# EAGLE design SMeter_Display_RevA (EAGLE 7.6.0)

## Sheet 1 of 2
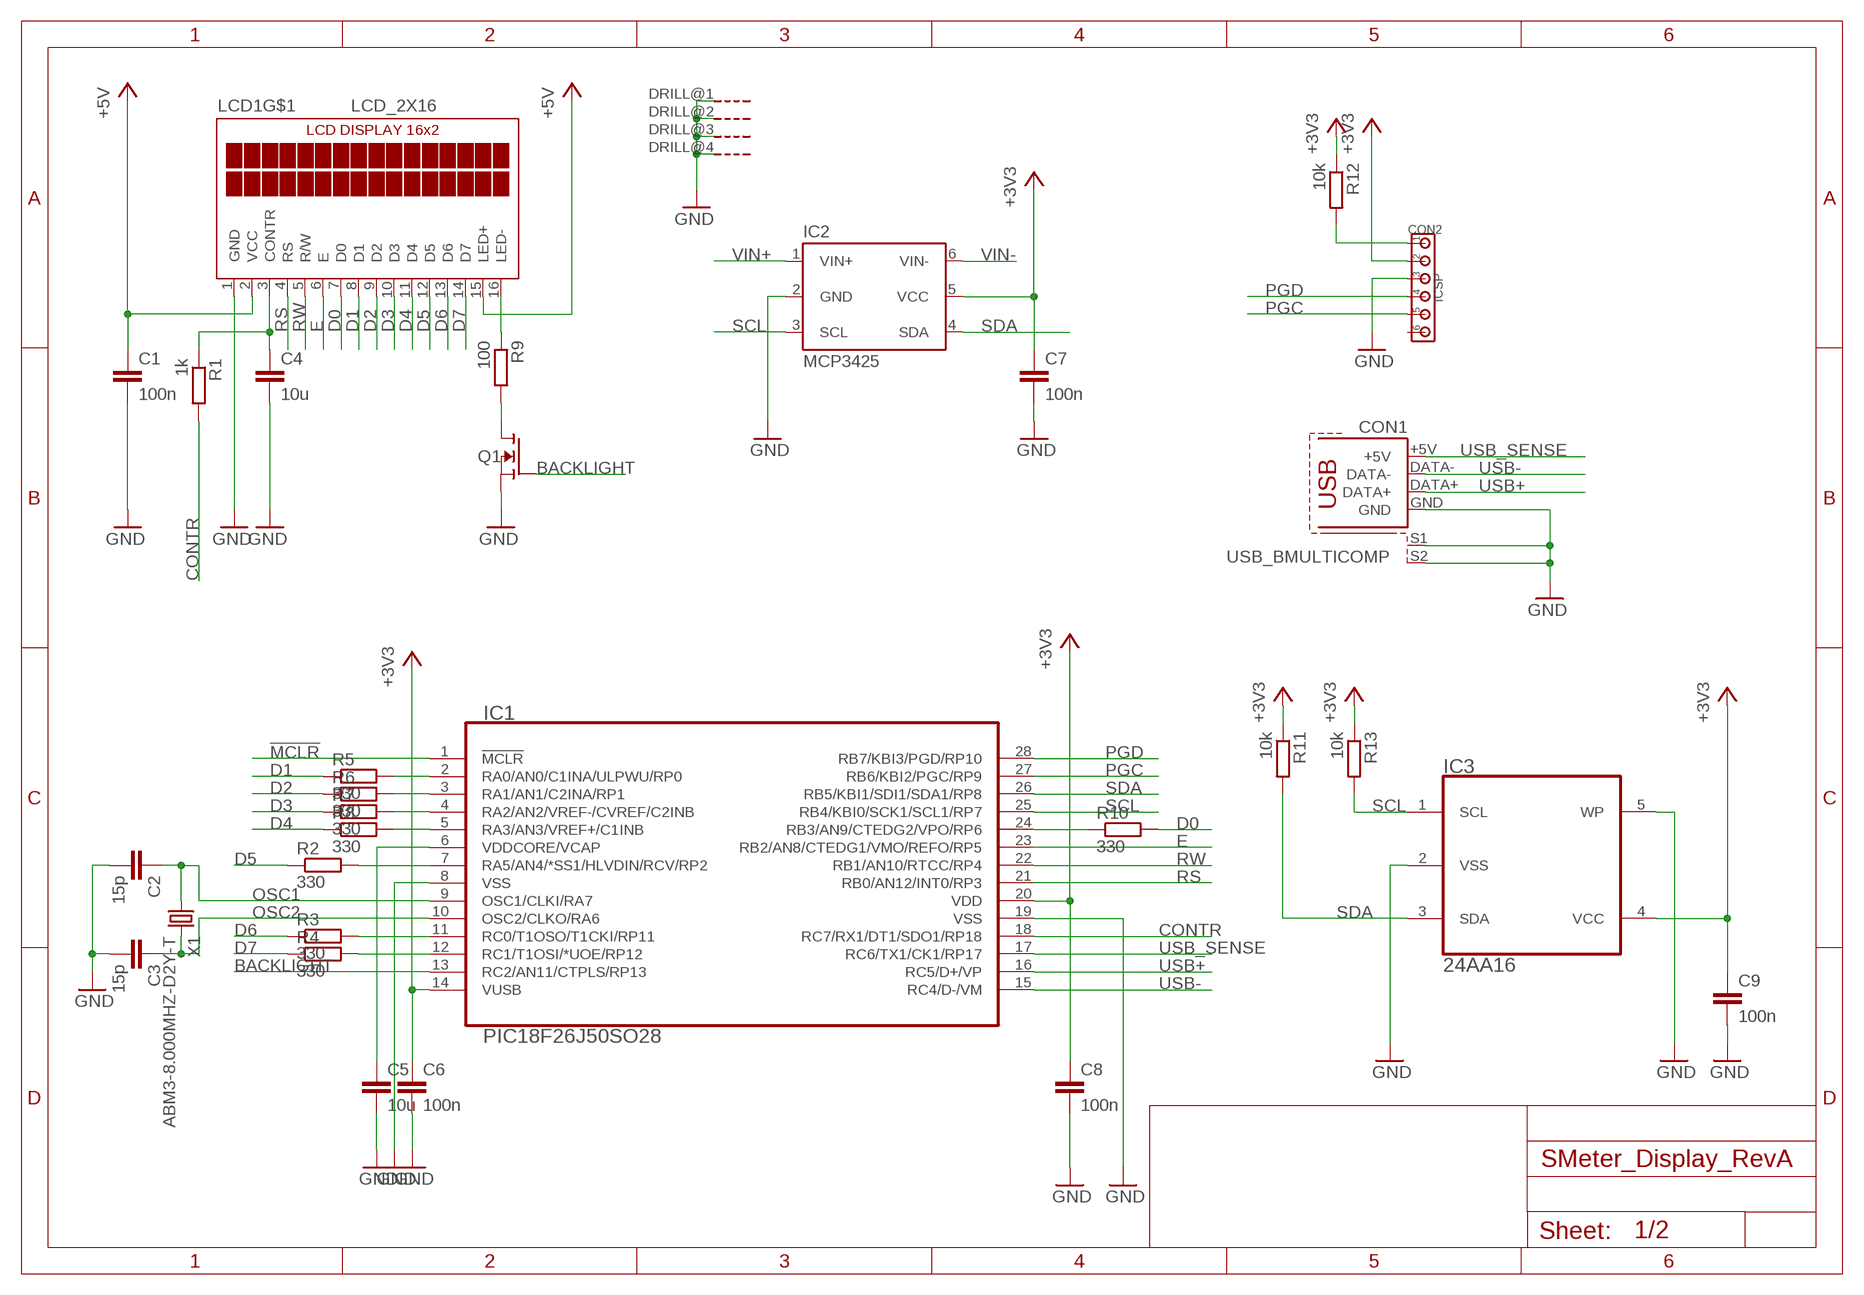
[diagram p0: schematic, sheet 1]

### Parts
C1  100n  CC0805  [C0805]
C2  15p  CC0805  [C0805]
C3  15p  CC0805  [C0805]
C4  10u  CC0805  [C0805]
C5  10u  CC0805  [C0805]
C6  100n  CC0805  [C0805]
C7  100n  CC0805  [C0805]
C8  100n  CC0805  [C0805]
C9  100n  CC0805  [C0805]
CON1  USB_BMULTICOMP  [USB_B]
CON2  ICSP  CON_6X100MIL  [100MIL_6X]
IC1  PIC18F26J50SO28  [SO28W]
IC2  MCP3425  [SOT-23-6]
IC3  24AA16  [SOT-23-5]
LCD1  LCD_2X16  [LCD_2X16]
Q1  N-FETSOT23  [SOT23]
R1  1k  RESISTORR0805  [R0805]
R2  330  RESISTORR0805  [R0805]
R3  330  RESISTORR0805  [R0805]
R4  330  RESISTORR0805  [R0805]
R5  330  RESISTORR0805  [R0805]
R6  330  RESISTORR0805  [R0805]
R7  330  RESISTORR0805  [R0805]
R8  330  RESISTORR0805  [R0805]
R9  100  RESISTORR0805  [R0805]
R10  330  RESISTORR0805  [R0805]
R11  10k  RESISTORR0805  [R0805]
R12  10k  RESISTORR0805  [R0805]
R13  10k  RESISTORR0805  [R0805]
X1  ABM3-8.000MHZ-D2Y-T  CRYSTAL5X3.2MM  [5X3.2MM]

### Nets
!MCLR!: CON2.1 IC1.1(!MCLR!) R12.2
+3V3: C6.1 C7.1 C8.1 C9.1 CON2.2 IC1.14(VUSB) IC1.20(VDD) IC2.5(VCC) IC3.4(VCC) R11.1 R12.1 R13.1 ; also sheet 2
+5V: C1.1 LCD1.2(VCC) LCD1.15(LED+) ; also sheet 2
BACKLIGHT: IC1.13(RC2/AN11/CTPLS/RP13) Q1.1(G)
CONTR: IC1.18(RC7/RX1/DT1/SDO1/RP18) R1.2
D0: LCD1.7(D0) R10.2
D1: LCD1.8(D1) R5.1
D2: LCD1.9(D2) R6.1
D3: LCD1.10(D3) R7.1
D4: LCD1.11(D4) R8.1
D5: LCD1.12(D5) R2.1
D6: LCD1.13(D6) R3.1
D7: LCD1.14(D7) R4.1
E: IC1.23(RB2/AN8/CTEDG1/VMO/REFO/RP5) LCD1.6(E)
GND: C1.2 C2.2 C3.2 C4.2 C5.2 C6.2 C7.2 C8.2 C9.2 CON1.GND CON1.S1 CON1.S2 CON2.3 IC1.8(VSS) IC1.19(VSS) IC2.2(GND) IC3.2(VSS) IC3.5(WP) LCD1.1(GND) LCD1.DRILL@1(G) LCD1.DRILL@2(G) LCD1.DRILL@3(G) LCD1.DRILL@4(G) Q1.2(S) ; also sheet 2
N$1: C5.1 IC1.6(VDDCORE/VCAP)
N$2: LCD1.16(LED-) R9.1
N$3: IC1.24(RB3/AN9/CTEDG2/VPO/RP6) R10.1
N$4: C4.1 LCD1.3(CONTR) R1.1
N$10: Q1.3(D) R9.2
N$11: IC1.2(RA0/AN0/C1INA/ULPWU/RP0) R5.2
N$12: IC1.3(RA1/AN1/C2INA/RP1) R6.2
N$13: IC1.4(RA2/AN2/VREF-/CVREF/C2INB) R7.2
N$14: IC1.5(RA3/AN3/VREF+/C1INB) R8.2
N$15: IC1.7(RA5/AN4/*SS1/HLVDIN/RCV/RP2) R2.2
N$16: IC1.11(RC0/T1OSO/T1CKI/RP11) R3.2
N$18: IC1.12(RC1/T1OSI/*UOE/RP12) R4.2
OSC1: C2.1 IC1.9(OSC1/CLKI/RA7) X1.1
OSC2: C3.1 IC1.10(OSC2/CLKO/RA6) X1.2
PGC: CON2.5 IC1.27(RB6/KBI2/PGC/RP9)
PGD: CON2.4 IC1.28(RB7/KBI3/PGD/RP10)
RS: IC1.21(RB0/AN12/INT0/RP3) LCD1.4(RS)
RW: IC1.22(RB1/AN10/RTCC/RP4) LCD1.5(R/W)
SCL: IC1.25(RB4/KBI0/SCK1/SCL1/RP7) IC2.3(SCL) IC3.1(SCL) R13.2
SDA: IC1.26(RB5/KBI1/SDI1/SDA1/RP8) IC2.4(SDA) IC3.3(SDA) R11.2
USB+: CON1.DATA+ IC1.16(RC5/D+/VP)
USB-: CON1.DATA- IC1.15(RC4/D-/VM)
USB_SENSE: CON1.+5V IC1.17(RC6/TX1/CK1/RP17)
VIN+: IC2.1(VIN+) ; also sheet 2
VIN-: IC2.6(VIN-) ; also sheet 2
Unconnected: CON2.6

## Sheet 2 of 2
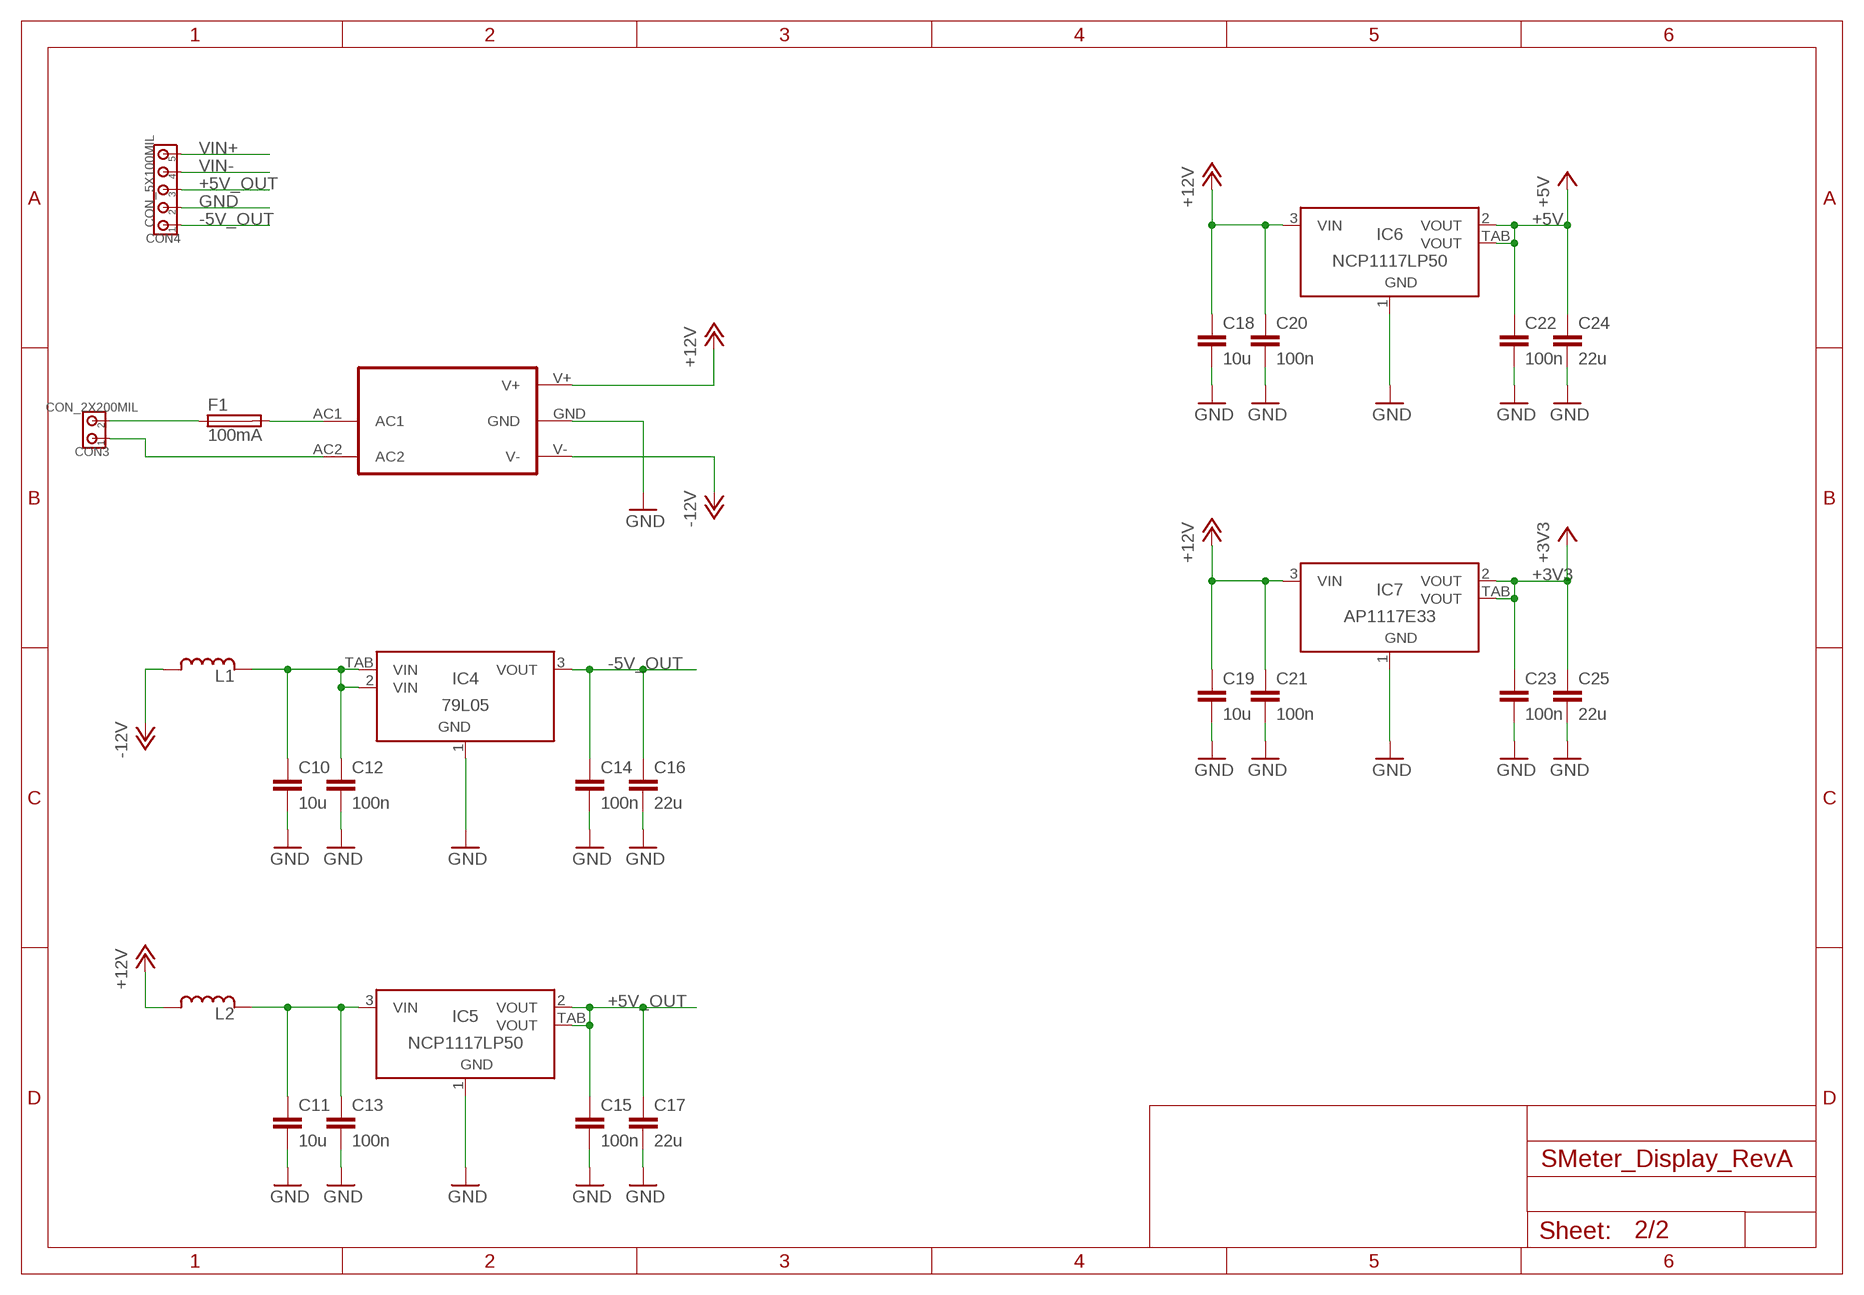
[diagram p1: schematic, sheet 2]

### Parts
ACDC1  MYRRA47247  [MYRRA47000]
C10  10u  CC1206  [C1206]
C11  10u  CC1206  [C1206]
C12  100n  CC0805  [C0805]
C13  100n  CC0805  [C0805]
C14  100n  CC0805  [C0805]
C15  100n  CC0805  [C0805]
C16  22u  CC1206  [C1206]
C17  22u  CC1206  [C1206]
C18  10u  CC1206  [C1206]
C19  10u  CC1206  [C1206]
C20  100n  CC0805  [C0805]
C21  100n  CC0805  [C0805]
C22  100n  CC0805  [C0805]
C23  100n  CC0805  [C0805]
C24  22u  CC1206  [C1206]
C25  22u  CC1206  [C1206]
CON3  CON_2X200MIL  [200MIL_2X]
CON4  CON_5X100MIL  [100MIL_5X]
F1  100mA  SH22,5  [SH22,5]
IC4  79L05  79L  [SOT-89]
IC5  NCP1117LP50  LD1117  [SOT223]
IC6  NCP1117LP50  LD1117  [SOT223]
IC7  AP1117E33  LD1117  [SOT223]
L1  INDUCTORLPS4018  [LPS4018]
L2  INDUCTORLPS4018  [LPS4018]

### Nets
+3V3: C23.1 C25.1 IC7.2(VOUT) IC7.TAB(VOUT) ; also sheet 1
+5V: C22.1 C24.1 IC6.2(VOUT) IC6.TAB(VOUT) ; also sheet 1
+5V_OUT: C15.1 C17.1 CON4.3 IC5.2(VOUT) IC5.TAB(VOUT)
+12V: ACDC1.V+ C18.1 C19.1 C20.1 C21.1 IC6.3(VIN) IC7.3(VIN) L2.1
-5V_OUT: C14.1 C16.1 CON4.1 IC4.3(VOUT)
-12V: ACDC1.V- L1.1
GND: ACDC1.GND C10.2 C11.2 C12.2 C13.2 C14.2 C15.2 C16.2 C17.2 C18.2 C19.2 C20.2 C21.2 C22.2 C23.2 C24.2 C25.2 CON4.2 IC4.1(GND) IC5.1(GND) IC6.1(GND) IC7.1(GND) ; also sheet 1
N$5: C10.1 C12.1 IC4.2(VIN) IC4.TAB(VIN) L1.2
N$6: C11.1 C13.1 IC5.3(VIN) L2.2
N$7 [mains]: ACDC1.AC1 F1.2
N$8 [mains]: ACDC1.AC2 CON3.1
N$9 [mains]: CON3.2 F1.1
VIN+: CON4.5 ; also sheet 1
VIN-: CON4.4 ; also sheet 1

## Library data of the parts
ACDC1 = 00ACDC:MYRRA47247: Dual Output AC/DC converter
C1-C25 = 00Capacitor:C: Capacitor
CON1 = 00Connector:USB_B: Type B USB connector
CON2 = 00Connector:CON_6X: 6-pin header
CON3 = 00Connector:CON_2X: 2-pin header
CON4 = 00Connector:CON_5X: 5-pin header
F1 = 00ACDC:SH22,5: FUSE HOLDER grid 22,5 mm, OGN0031 8201, Schurter (Buerklin); MF: SCHURTER; MPN: 0031.8201; OC_FARNELL: 1162740; OC_NEWARK: 96F8317
IC1 = 00PIC:PIC18F*J50: PIC18F Series 28-Pin Microcontroller; MEMORY: 64k
IC2 = 00ADC:MCP3425: 1-Channel, 16-bit ADC
IC3 = 00Logic:24AA16: 16K I2C Serial EEPROM
IC4 = 00VoltageRegulator:79L*: Negative Voltage Regulator
IC5-IC7 = 00VoltageRegulator:LD1117: Positive Voltage Regulator 800mA
L1 L2 = 00Inductor:INDUCTOR
LCD1 = 00Display:LCD_2X16
Q1 = 00Mosfet:N-FET: N-Channel MOSFET
R1-R13 = 00Resistor:RESISTOR: RESISTOR, European symbol
X1 = 00Crystal:CRYSTAL: Crystal

## Net classes
1 mains: clearance 1.016 mm

## Board
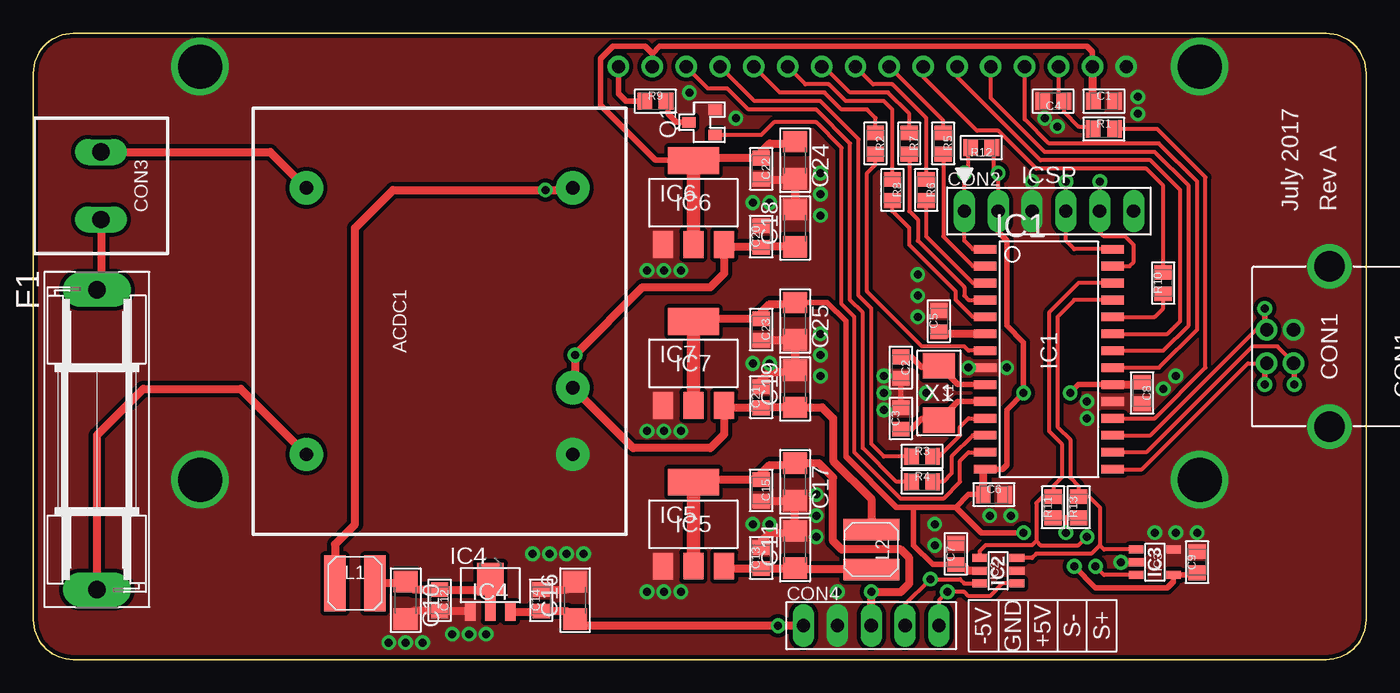
[diagram p2: board, top side]
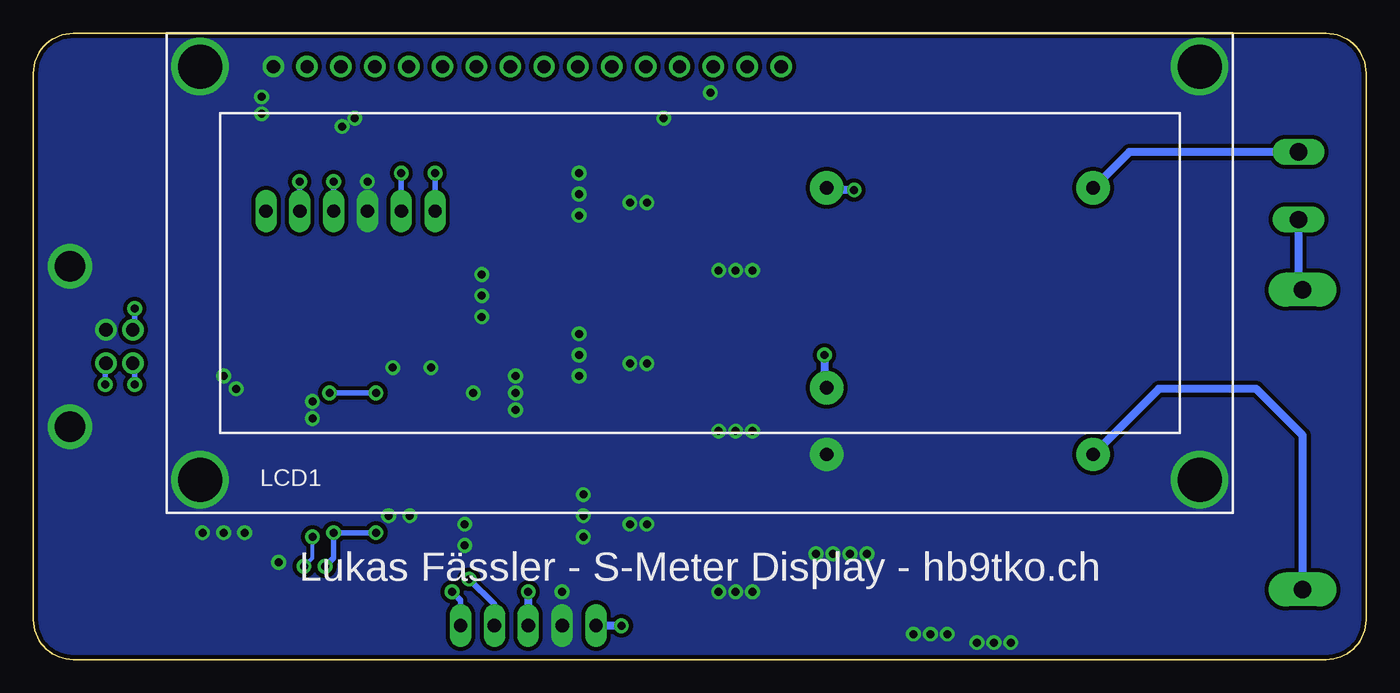
[diagram p3: board, bottom side, seen from below]

Size 100 x 47 mm. Coordinates in mm from the lower left corner, seen from the top.
Outline: 0,44 arc-90 3,47 97,47 arc-90 100,44 100,3 arc-90 97,0 3,0 arc-90 0,3 0,44
Copper layers (1*16): Top 0.035mm / dielectric 1.5mm / Bottom 0.035mm
Design rules "LPKF_Compatible *": minimum track width 8mil, minimum drill 23mil, track to track 8mil, track to pad 8mil, pad to pad 8mil, via to via 8mil, smd to smd 0mil, copper to edge 10mil, drill to drill 10mil, minimum pad ring 12mil, minimum via ring 10mil, stop-mask expansion 2mil, vias tented up to drill 25mil, thermal gap 10mil

### Footprints (pad centres in the part's own frame; a part is rotated, then mirrored left to right if it is on the bottom)
MYRRA47000 = drill 1 pad 2.5: AC1 -10,10; AC2 10,10; GND -10,-10; V+ -5,-10; V- 10,-10
C0805 = smd 1.1 x 1.3: 1 -0.8,0; 2 0.8,0
C1206 = smd 1.6 x 1.8: 1 -1.4,0; 2 1.4,0
USB_B = drill 1 pad 1.6: +5V 1.25,4.71; DATA+ -1.25,2.71; DATA- -1.25,4.71; GND 1.25,2.71 | drill 2.3 pad 3: S1 -6.02,0; S2 6.02,0
100MIL_6X = drill 1 long: 1 -6.35,0; 2 -3.81,0; 3 -1.27,0; 4 1.27,0; 5 3.81,0; 6 6.35,0
200MIL_2X = drill 1.3 long: 1 -2.54,0; 2 2.54,0
100MIL_5X = drill 1 long: 1 -5.08,0; 2 -2.54,0; 3 0,0; 4 2.54,0; 5 5.08,0
SH22,5 = drill 1.321 pad 2.54 long: 1 -11.252,0; 2 11.252,0
SO28W = smd 0.65 x 1.7: 1 -7.62,-4.78; 2 -6.35,-4.78; 3 -5.08,-4.78; 4 -3.81,-4.78; 5 -2.54,-4.78; 6 -1.27,-4.78; 7 0,-4.78; 8 1.27,-4.78; 9 2.54,-4.78; 10 3.81,-4.78; 11 5.08,-4.78; 12 6.35,-4.78; 13 7.62,-4.78; 14 8.89,-4.78; 15 8.89,4.78; 16 7.62,4.78; 17 6.35,4.78; 18 5.08,4.78; 19 3.81,4.78; 20 2.54,4.78; 21 1.27,4.78; 22 0,4.78; 23 -1.27,4.78; 24 -2.54,4.78; 25 -3.81,4.78; 26 -5.08,4.78; 27 -6.35,4.78; 28 -7.62,4.78
SOT-23-6 = smd 0.6 x 1.1: 1 -0.95,-1.4; 2 0,-1.4; 3 0.95,-1.4; 4 0.95,1.4; 5 0,1.4; 6 -0.95,1.4
SOT-23-5 = smd 0.6 x 1.1: 1 -0.95,-1.4; 2 0,-1.4; 3 0.95,-1.4; 4 0.95,1.4; 5 -0.95,1.4
SOT-89 = smd 0.8 x 1.4: 1 -1.499,-1.481; 3 1.499,-1.481 | smd 0.8 x 1.9: 2 0,-1.227 | smd 2 x 2.45: TAB 0,0.95
SOT223 = smd 1.5 x 2: 1 -2.3,-3.15; 2 0,-3.15; 3 2.3,-3.15 | smd 3.8 x 2: TAB 0,3.15
LPS4018 = smd 1.6 x 4.2: 1 -1.5,0; 2 1.5,0
LCD_2X16 = drill 1: 1 8,33.5; 2 10.54,33.5; 3 13.08,33.5; 4 15.62,33.5; 5 18.16,33.5; 6 20.7,33.5; 7 23.24,33.5; 8 25.78,33.5; 9 28.32,33.5; 10 30.86,33.5; 11 33.4,33.5; 12 35.94,33.5; 13 38.48,33.5; 14 41.02,33.5; 15 43.56,33.5; 16 46.1,33.5 | drill 3.3: DRILL@1 2.5,33.5; DRILL@2 77.5,33.5; DRILL@3 77.5,2.5; DRILL@4 2.5,2.5
SOT23 = smd 0.8 x 1: 1 -0.95,-1; 2 0.95,-1; 3 0,1
R0805 = smd 1.1 x 1.3: 1 -0.8,0; 2 0.8,0
5X3.2MM = smd 1.9 x 2.4: 1 -2.05,0; 2 2.05,0

### Placement (x,y rotation side)
ACDC1  30.48,25.4 90 top
C1  80.33,41.91 0 top
C2  65.09,21.91 270 top
C3  65.09,18.1 90 top
C4  76.52,41.91 180 top
C5  67.94,25.4 90 top
C6  72.07,12.38 0 top
C7  69.22,7.94 90 top
C8  83.19,20 270 top
C9  87.31,7.3 90 top
C10  27.94,4.45 270 top
C11  57.15,8.26 90 top
C12  30.48,4.45 270 top
C13  54.61,7.62 90 top
C14  38.1,4.45 90 top
C15  54.61,12.7 270 top
C16  40.64,4.45 90 top
C17  57.15,13.34 270 top
C18  57.15,32.38 90 top
C19  57.15,20.32 90 top
C20  54.61,31.75 90 top
C21  54.61,19.68 90 top
C22  54.61,36.83 270 top
C23  54.61,24.77 270 top
C24  57.15,37.47 270 top
C25  57.15,25.4 270 top
CON1  97.25,23.5 90 top
CON2  76.2,33.66 0 top
CON3  5.08,35.56 270 top
CON4  62.87,2.54 0 top
F1  4.76,16.51 270 top
IC1  76.2,23.18 270 top
IC2  72.39,6.67 90 top
IC3  84.14,7.3 270 top
IC4  34.29,5.08 0 top
IC5  49.53,10.16 0 top
IC6  49.53,34.29 0 top
IC7  49.53,22.23 0 top
L1  24.13,5.71 0 top
L2  62.87,8.26 270 top
LCD1  90,11 0 bottom
Q1  50.16,40.32 90 top
R1  80.32,39.82 0 top
R2  63.18,38.73 270 top
R3  66.67,15.24 0 top
R4  66.67,13.34 0 top
R5  68.26,38.73 270 top
R6  66.99,35.24 270 top
R7  65.72,38.73 270 top
R8  64.45,35.24 270 top
R9  46.67,41.91 0 top
R10  84.77,28.26 90 top
R11  76.52,11.43 90 top
R12  71.12,38.42 180 top
R13  78.42,11.43 90 top
X1  67.94,20 270 top

### Tracks (layer width: path | path; a pad name or v marks a point on that pad's centre or on a via)
!MCLR!  (via drill 0.6)
  Top 0.305: IC1.1 70.48,30.8 69.85,31.43 CON2.1 v69.85,36.51 70.17,36.83 70.17,38.27 R12.2
  Bottom 0.406: v69.85,36.51 CON2.1
+3V3  (via drill 0.6)
  Top 0.305: CON2.2 v72.39,36.51 72.07,36.83 72.07,38.27 R12.1
  Top 0.406: C9.1 87.16,6.35 IC3.4 85.54,5.84 85.09,5.4 79.69,5.4 v78.11,6.99 | R13.1 77.47,10.63 | 77.47,10.63 R11.1 | CON2.2 72.39,32.07 73.03,31.43 73.03,25.08 74.3,23.81 v74.3,20 73.03,18.73 73.03,14.61 72.71,14.29 IC1.14 | C25.1 59.56,26.8 60.96,25.4 60.96,15.24 64.77,11.43 66.04,11.43 | 66.04,11.43 69.22,11.43 | C6.1 70.17,12.38 69.22,11.43 | C7.1 67.47,7.14 66.04,8.57 66.04,11.43 | IC1.20 78.42,20.64 v77.79,20 | v74.3,9.53 71.12,9.53 69.22,11.43 | v77.47,9.53 77.47,10.63
  Top 0.61: IC7.TAB 49.72,25.57 C23.1 54.61,26.04 55.24,26.67 57.02,26.67 C25.1 | C6.1 71.27,14.14 IC1.14 | IC1.20 83.02,20.64 C8.1 | IC2.5 70.17,6.67 69.85,6.99 69.37,6.99 C7.1
  Top 1.016: IC7.2 IC7.TAB
  Bottom 0.406: v77.79,20 v74.3,20 | v74.3,9.53 v77.47,9.53 77.47,7.62 v78.11,6.99 | v72.39,36.51 CON2.2
+5V
  Top 0.406: LCD1.2 79.46,45.63 79.06,46.04 46.99,46.04 46.44,45.49 | LCD1.15 46.44,45.49 | 46.44,45.49 45.89,46.04 43.5,46.04 42.55,45.09 42.55,41.59 46.67,37.47 49.51,37.47 IC6.TAB
  Top 0.61: IC6.TAB 49.72,37.63 C22.1 54.61,38.1 55.24,38.73 57.02,38.73 C24.1 | LCD1.2 79.46,41.98 C1.1
  Top 1.016: IC6.2 IC6.TAB
+5V_OUT  (via drill 0.6)
  Top 0.61: IC5.TAB 49.72,13.5 C15.1 54.61,13.97 55.24,14.61 57.02,14.61 C17.1 58.92,14.73 60.01,13.65 60.01,8.89 60.64,8.26 65.09,8.26 65.72,7.62 65.72,5.71 65.09,5.08 v62.87,5.08 CON4.3
  Top 1.016: IC5.TAB IC5.2
  Bottom 0.61: v62.87,5.08 CON4.3
+12V  (via drill 0.6)
  Top 0.61: C18.1 54.65,30.98 C20.1 52.02,30.95 IC6.3 51.83,28.97 50.8,27.94 45.72,27.94 v40.64,22.86 40.64,20.56 ACDC1.V+ 45.01,15.88 50.8,15.88 51.83,16.91 IC7.3 52.02,18.89 C21.1 54.65,18.92 C19.1 59.19,18.92 60.01,18.1 60.01,14.92 62.87,12.06 L2.1
  Bottom 0.61: v40.64,22.86 40.64,20.64 40.32,20.32
-5V_OUT  (via drill 0.6)
  Top 0.61: IC4.3 38.05,3.6 C14.1 40.04,3.65 C16.1 41.15,2.54 v55.88,2.54 CON4.1
  Bottom 0.61: v55.88,2.54 CON4.1
-12V  (via drill 0.6)
  Top 0.61: ACDC1.V- 40.32,35.24 v38.42,35.24 26.99,35.24 24.13,32.38 24.13,10.16 22.63,8.66 L1.1
  Bottom 0.61: v38.42,35.24 40.64,35.24
BACKLIGHT
  Top 0.305: IC1.13 70.17,15.56 69.53,14.92 69.53,13.34 68.26,12.06 65.09,12.06 61.59,15.56 61.59,25.72 60.64,26.67 60.64,38.42 58.74,40.32 55.56,40.32 54.61,39.37 Q1.1
CONTR
  Top 0.305: IC1.18 84.14,18.1 87.95,21.91 87.95,36.2 84.33,39.82 R1.2
D0
  Top 0.305: R10.2 84.77,35.56 83.5,36.83 75.25,36.83 72.39,39.69 70.8,39.69 66.76,43.73 LCD1.7
D1
  Top 0.305: R5.1 68.26,40.46 LCD1.8
D2
  Top 0.305: R6.1 66.99,40.64 64.45,43.18 63,43.18 LCD1.9
D3
  Top 0.305: R7.1 65.72,40.96 64.14,42.55 61.28,42.55 59.32,44.5 LCD1.10
D4
  Top 0.305: R8.1 64.45,41.27 63.82,41.91 60.96,41.91 59.69,43.18 57.92,43.18 LCD1.11
D5
  Top 0.305: R2.1 63.18,40.64 62.55,41.27 60.64,41.27 59.37,42.55 56.02,42.55 LCD1.12
D6
  Top 0.305: R3.1 63.82,15.24 62.87,16.19 62.87,26.35 61.91,27.3 61.91,39.05 59.05,41.91 54.11,41.91 LCD1.13
D7
  Top 0.305: R4.1 64.77,13.34 62.23,15.88 62.23,26.04 61.28,26.99 61.28,38.73 58.74,41.27 53.66,41.27 52.07,42.86 50.62,42.86 LCD1.14
E
  Top 0.305: IC1.23 85.09,24.45 86.04,25.4 86.04,35.24 83.82,37.47 75.56,37.47 69.3,43.73 LCD1.6
GND  (via drill 0.6, 0.6 pad 0.3)
  Top 0.406: C3.2 C2.2
  Top 0.61: C10.2 28.54,3.65 C12.2 32.74,3.65 IC4.1 | C14.2 40.04,5.25 C16.2 | C22.2 57.12,36.03 C24.2 C18.2 | C23.2 57.12,23.96 C25.2 C19.2 57.02,21.59 55.24,21.59 54.61,20.95 C21.2 | C15.2 57.12,11.9 | 57.12,11.9 C17.2 | 57.12,11.9 57.12,9.69 C11.2 57.02,9.53 55.24,9.53 54.61,8.89 C13.2
  other vias: 76.83,40.01 79.06,19.37 79.06,18.1 84.77,20.32 75.88,40.64 49.21,42.55 52.7,40.64 66.36,28.89 63.82,21.27 66.99,20 63.82,18.73 46.04,5.08 47.31,5.08 48.58,5.08 48.58,17.14 47.31,17.14 46.04,17.14 47.31,29.21 48.58,29.21 46.04,29.21 32.7,1.91 31.43,1.91 33.97,1.91 26.67,1.27 27.94,1.27 29.21,1.27 37.47,7.94 38.73,7.94 40.01,7.94 41.27,7.94 53.98,10.16 55.24,10.16 53.98,22.23 55.24,22.23 59.05,21.27 59.05,22.86 59.05,24.45 53.98,34.29 55.24,34.29 59.05,33.34 59.05,34.92 59.05,36.51 58.74,12.38 58.74,10.79 58.74,9.21 73.03,21.91 73.34,10.79 71.75,10.79 67.63,10.16 67.63,8.57 74.93,35.88 70.17,21.91 85.72,21.27 82.87,42.23 82.87,40.96 84.14,9.53 85.72,9.53 87.31,9.53 66.36,27.3 66.36,25.72 63.82,20 81.6,7.3 60.33,5.08
  pour Bottom (isolate 0.305, no thermals): 0,30 0,44 arc-90 3,47 25,47 97,47 arc-90 100,44 100,26 100,3 arc-90 97,0 73,0 3,0 arc-90 0,3
  pour Top (isolate 0.305, no thermals): 0,30 0,44 arc-90 3,47 17,47 97,47 arc-90 100,44 100,29 100,3 arc-90 97,0 73,0 3,0 arc-90 0,3
N$1
  Top 0.61: IC1.6 67.94,24.45 C5.1
N$2
  Top 0.406: R9.1 44.45,41.91 43.9,42.46 LCD1.16
N$3
  Top 0.305: IC1.24 84.14,25.72 84.77,26.35 R10.1
N$4
  Top 0.305: R1.1 79.33,40.01 78.42,40.01 77.32,41.11 C4.1 76.92,42.31 LCD1.3
N$5
  Top 0.61: 33.81,5.55 33.51,5.25 C12.1 28.54,5.25 C10.1 27.81,5.71 L1.2 | 33.81,5.55 IC4.TAB | IC4.2 34.29,5.08 33.81,5.55
N$6
  Top 0.61: IC5.3 arc90 52.02,6.82 C13.1 54.65,6.86 C11.1 57.25,6.75 L2.2
N$7
  Top 0.61: ACDC1.AC1 15.56,20.32 8.26,20.32 4.76,16.83 F1.2
  Bottom 0.61: F1.2 4.76,16.83 8.26,20.32 15.56,20.32 20.64,15.24
N$8
  Top 0.61: CON3.1 17.78,38.1 ACDC1.AC2
  Bottom 0.61: CON3.1 17.78,38.1 20.64,35.24
N$9
  Top 0.61: CON3.2 5.08,27.76 F1.1
  Bottom 0.61: CON3.2 5.08,27.94
N$10
  Top 0.406: Q1.3 48.26,40.32 47.62,40.96 47.62,41.76 R9.2
N$11
  Top 0.305: R5.2 68.26,31.75 70.48,29.53 IC1.2
N$12
  Top 0.305: IC1.3 70.48,28.26 66.99,31.75 R6.2
N$13
  Top 0.305: R7.2 65.72,33.66 66.36,33.02 66.36,31.43 69.85,27.94 69.85,27.3 70.17,26.99 IC1.4
N$14
  Top 0.305: IC1.5 70.48,25.72 69.22,26.99 69.22,27.62 65.72,31.11 65.72,32.38 64.45,33.66 R8.2
N$15
  Top 0.305: IC1.7 70.17,23.18 69.85,23.5 66.67,23.5 62.55,27.62 62.55,36.51 63.18,37.15 R2.2
N$16
  Top 0.305: R3.2 67.94,15.24 69.53,16.83 69.53,17.46 70.17,18.1 IC1.11
N$18
  Top 0.305: IC1.12 70.48,16.83 68.9,15.24 68.9,13.97 68.26,13.34 R4.2
OSC1
  Top 0.406: IC1.9 69.36,20.64 X1.1 67.8,21.91 66.67,21.91 65.88,22.71 C2.1
OSC2
  Top 0.406: IC1.10 69.36,19.37 X1.2 67.8,18.1 66.67,18.1 65.88,17.3 C3.1
PGC  (via drill 0.6)
  Top 0.305: IC1.27 82.23,29.53 82.55,29.84 82.55,31.11 81.92,31.75 80.33,31.75 80.01,32.07 CON2.5 v80.01,35.88
  Bottom 0.406: v80.01,35.88 CON2.5
PGD  (via drill 0.6)
  Top 0.305: IC1.28 78.11,30.8 77.47,31.43 CON2.4 v77.47,35.88
  Bottom 0.406: CON2.4 v77.47,35.88
RS
  Top 0.305: IC1.21 84.45,21.91 87.31,24.77 87.31,35.88 84.45,38.73 76.2,38.73 74.38,40.55 LCD1.4
RW
  Top 0.305: IC1.22 84.77,23.18 86.68,25.08 86.68,35.56 84.14,38.1 75.88,38.1 71.84,42.14 LCD1.5
SCL
  Top 0.305: IC1.25 78.11,26.99 76.83,25.72 76.83,17.46 77.79,16.51 77.79,13.65 78.42,13.02 R13.2 79.21,12.23 80.01,11.43 80.01,8.57 | 80.01,8.57 79.38,7.94 75.25,7.94 74.93,7.62 IC2.3 | IC3.1 80.33,8.25 80.01,8.57
SDA  (via drill 0.6)
  Top 0.305: IC1.26 78.42,28.26 76.2,26.04 76.2,17.14 77.15,16.19 77.15,13.65 76.52,13.02 R11.2 75.73,12.23 75.25,11.75 75.25,8.89 | IC3.3 80.33,6.35 v79.69,6.99 | 75.25,8.89 74.93,8.57 71.44,8.57 70.99,8.12 IC2.4 | 75.25,8.89 75.56,8.57 78.42,8.57 v79.06,9.21
  Bottom 0.305: v79.69,6.99 79.06,7.62 v79.06,9.21
USB+  (via drill 0.6)
  Top 0.305: CON1.DATA+ 94.54,22.3 93.34,23.5 91.44,23.5 83.5,15.56 IC1.16
  Top 0.406: v94.61,20.64 94.61,22.18 CON1.DATA+
  Bottom 0.406: v94.61,20.64 94.61,22.23
USB-  (via drill 0.6)
  Top 0.305: IC1.15 83.19,14.29 91.12,22.23 92.52,22.23 CON1.DATA-
  Top 0.406: v92.39,20.64 92.39,22.1 CON1.DATA-
  Bottom 0.406: v92.39,20.64 92.39,22.23
USB_SENSE  (via drill 0.6)
  Top 0.305: IC1.17 83.82,16.83 91.76,24.77 92.53,24.77 CON1.+5V
  Top 0.406: v92.39,26.35 92.39,24.9 CON1.+5V
  Bottom 0.406: v92.39,26.35 92.39,24.77
VIN+  (via drill 0.6)
  Top 0.305: IC2.1 72.71,5.72 71.75,4.76 70.17,4.76 69.85,5.08 v68.58,5.08 67.94,4.45 CON4.5
  Bottom 0.406: v68.58,5.08 67.94,4.45 CON4.5
VIN-  (via drill 0.6)
  Top 0.305: CON4.4 65.41,4.13 v67.31,6.03 69.53,6.03 69.85,5.71 IC2.6
  Bottom 0.406: CON4.4 65.41,4.13 v67.31,6.03

### Text on the board
tPlace: ICSP | July 2017 | Rev A | -5V | GND | +5V | S- | S+
bPlace: Lukas Fässler - S-Meter Display - hb9tko.ch